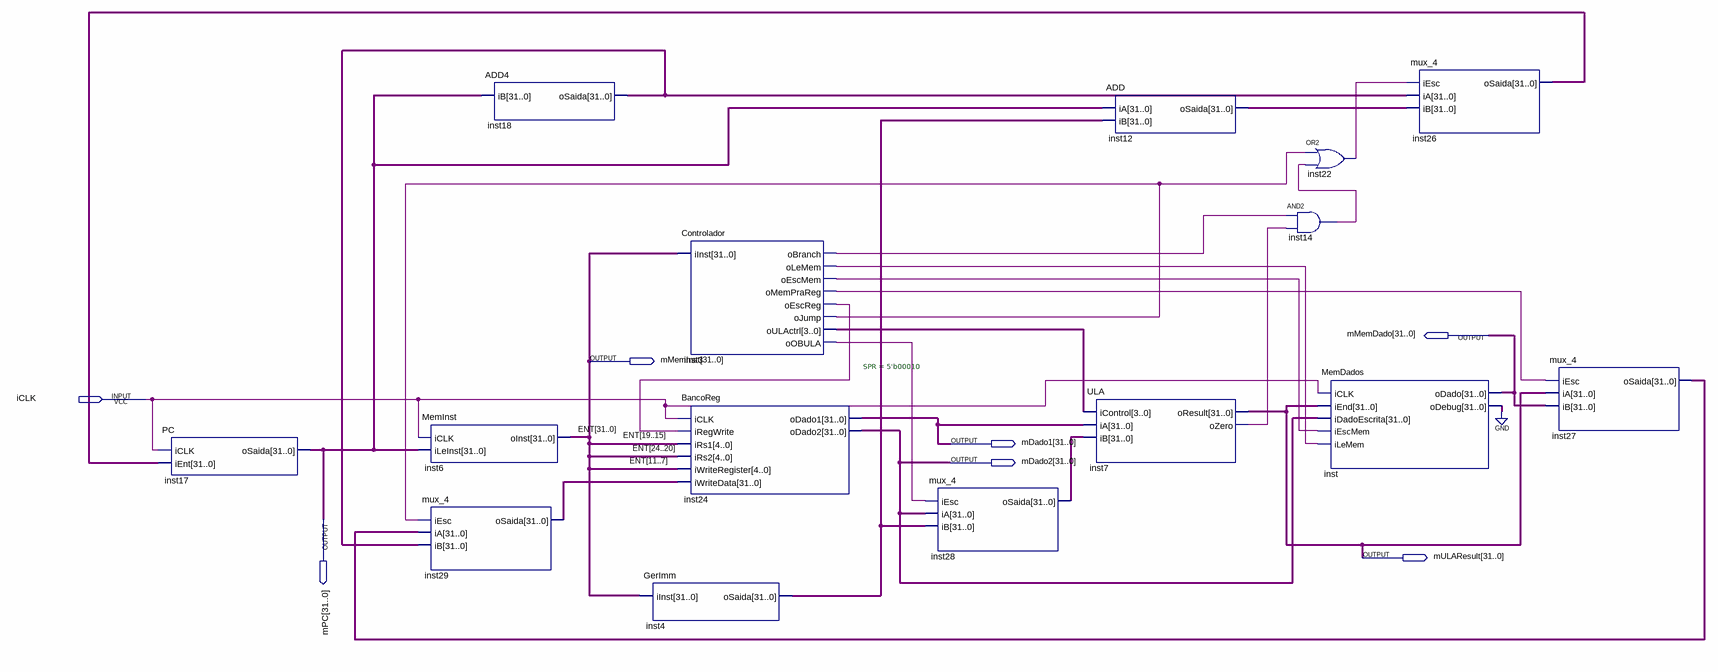
[diagram p0: schematic sheet]
// Quartus schematic uniciclo.bdf as structural Verilog: 15 symbols, 7 pins
module uniciclo (
  input  iCLK,
  output [31:0] mMemDado,
  output [31:0] mMemInst,
  output [31:0] mDado1,
  output [31:0] mDado2,
  output [31:0] mPC,
  output [31:0] mULAResult
);

  wire inst3_obranch, inst3_oescmem, inst3_oescreg, inst3_ojump, inst3_olemem, inst3_omemprareg,
       inst3_oobula, inst7_ozero, inst14_out, inst22_out;
  wire [3:0] inst3_oulactrl;
  wire [31:0] inst4_osaida, inst12_osaida, inst18_osaida, inst26_osaida, inst27_osaida, inst28_osaida,
       inst29_osaida, inst_odebug;

  PC inst17 (.iCLK(iCLK), .iEnt(inst26_osaida), .oSaida(mPC));
  MemInst inst6 (.iCLK(iCLK), .iLeInst(mPC), .oInst(mMemInst));
  mux_4 inst29 (.iEsc(inst3_ojump), .iA(inst27_osaida), .iB(inst18_osaida), .oSaida(inst29_osaida));
  ADD4 inst18 (.iB(mPC), .oSaida(inst18_osaida));
  Controlador inst3 (
    .iInst(mMemInst), .oBranch(inst3_obranch), .oLeMem(inst3_olemem), .oEscMem(inst3_oescmem),
    .oMemPraReg(inst3_omemprareg), .oEscReg(inst3_oescreg), .oJump(inst3_ojump), .oULActrl(inst3_oulactrl),
    .oOBULA(inst3_oobula));
  BancoReg #(.SPR(5'b00010)) inst24 (
    .iCLK(iCLK), .iRegWrite(inst3_oescreg), .iRs1(mMemInst[19:15]), .iRs2(mMemInst[24:20]),
    .iWriteRegister(mMemInst[11:7]), .iWriteData(inst29_osaida), .oDado1(mDado1), .oDado2(mDado2));
  GerImm inst4 (.iInst(mMemInst), .oSaida(inst4_osaida));
  mux_4 inst28 (.iEsc(inst3_oobula), .iA(mDado2), .iB(inst4_osaida), .oSaida(inst28_osaida));
  ULA inst7 (.iControl(inst3_oulactrl), .iA(mDado1), .iB(inst28_osaida), .oResult(mULAResult), .oZero(inst7_ozero));
  ADD inst12 (.iA(mPC), .iB(inst4_osaida), .oSaida(inst12_osaida));
  and inst14 (inst14_out, inst3_obranch, inst7_ozero);
  or inst22 (inst22_out, inst3_ojump, inst14_out);
  MemDados inst (
    .iCLK(iCLK), .iEnd(mULAResult), .iDadoEscrita(mDado2), .iEscMem(inst3_oescmem), .iLeMem(inst3_olemem),
    .oDado(mMemDado), .oDebug(inst_odebug));
  mux_4 inst26 (.iEsc(inst22_out), .iA(inst18_osaida), .iB(inst12_osaida), .oSaida(inst26_osaida));
  mux_4 inst27 (.iEsc(inst3_omemprareg), .iA(mULAResult), .iB(mMemDado), .oSaida(inst27_osaida));
  // also tied to GND on the sheet: {inst_odebug[0], inst_odebug[1], inst_odebug[2], inst_odebug[3], inst_odebug[4], inst_odebug[5], inst_odebug[6], inst_odebug[7], inst_odebug[8], inst_odebug[9], inst_odebug[10], inst_odebug[11], inst_odebug[12], inst_odebug[13], inst_odebug[14], inst_odebug[15], inst_odebug[16], inst_odebug[17], inst_odebug[18], inst_odebug[19], inst_odebug[20], inst_odebug[21], inst_odebug[22], inst_odebug[23], inst_odebug[24], inst_odebug[25], inst_odebug[26], inst_odebug[27], inst_odebug[28], inst_odebug[29], inst_odebug[30], inst_odebug[31]}

  // Other names for the same wires on the sheet: ENT[31:0] = mMemInst
endmodule
